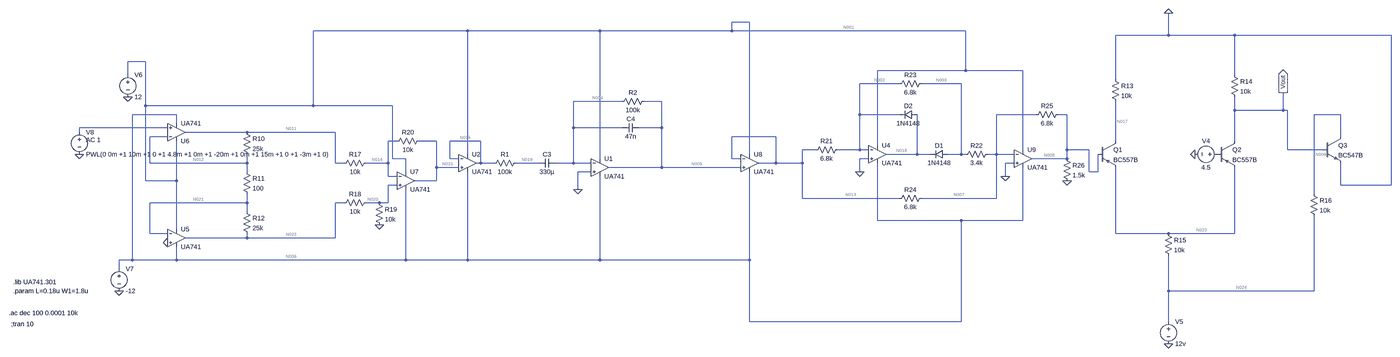
[diagram p0: schematic Project2final.asc, whole sheet]
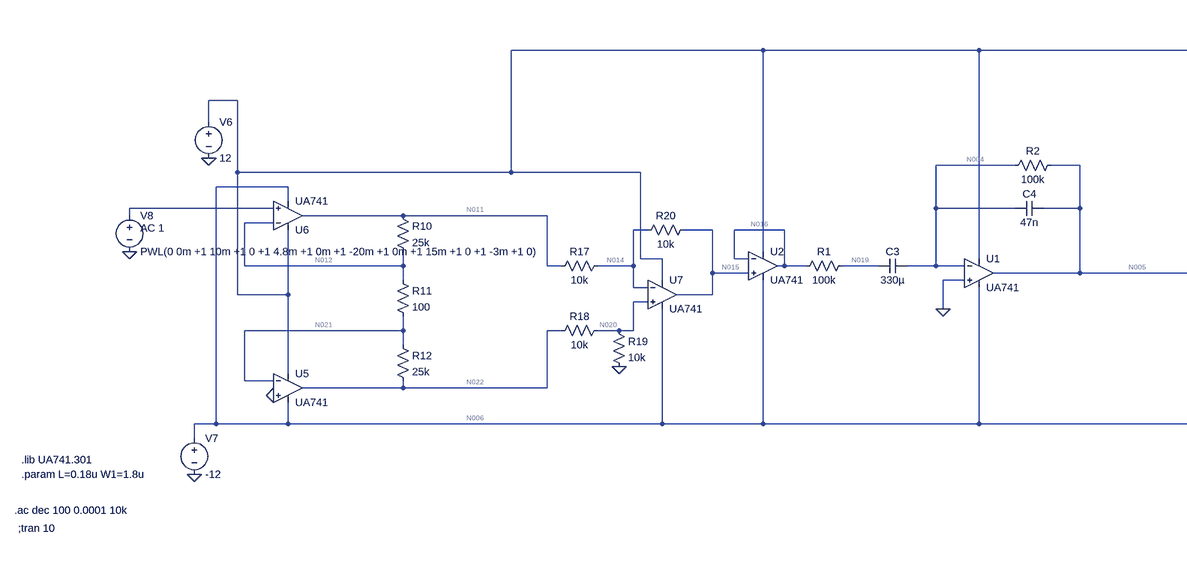
[diagram p1: schematic Project2final.asc, part, row 1 of 1, column 1 of 2]
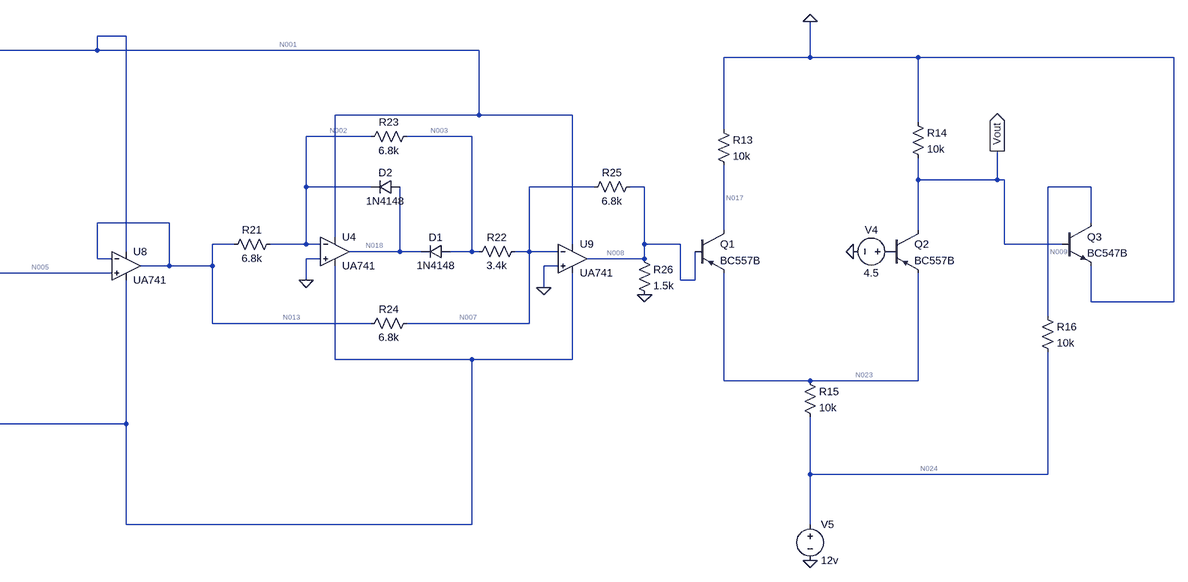
[diagram p2: schematic Project2final.asc, part, row 1 of 1, column 2 of 2]
Project2final.asc, the LTspice schematic file:
Version 4
SHEET 1 8356 2400
WIRE 2832 -224 2768 -224
WIRE 1776 -192 1216 -192
WIRE 2256 -192 1776 -192
WIRE 2768 -192 2768 -224
WIRE 2768 -192 2256 -192
WIRE 3616 -192 2768 -192
WIRE 4352 -176 4352 -256
WIRE 4352 -176 4160 -176
WIRE 4592 -176 4352 -176
WIRE 5200 -176 4592 -176
WIRE 608 -80 544 -80
WIRE 3616 -48 3616 -192
WIRE 3616 -48 3296 -48
WIRE 3824 -48 3616 -48
WIRE 544 -32 544 -80
WIRE 4592 -32 4592 -176
WIRE 4160 -16 4160 -176
WIRE 3376 0 3232 0
WIRE 3600 0 3456 0
WIRE 2336 64 2160 64
WIRE 2480 64 2416 64
WIRE 608 80 608 -80
WIRE 1216 80 1216 -192
WIRE 1216 80 608 80
WIRE 1504 80 1216 80
WIRE 4592 96 4592 48
WIRE 4768 96 4768 32
WIRE 4768 96 4592 96
WIRE 4784 96 4768 96
WIRE 720 112 560 112
WIRE 3232 112 3232 0
WIRE 3376 112 3232 112
WIRE 3872 112 3728 112
WIRE 3984 112 3952 112
WIRE 4976 112 4880 112
WIRE 720 144 720 112
WIRE 688 160 368 160
WIRE 2160 160 2160 64
WIRE 2336 160 2160 160
WIRE 2480 160 2480 64
WIRE 2480 160 2400 160
WIRE 368 176 368 160
WIRE 976 176 752 176
WIRE 1296 176 976 176
WIRE 688 192 624 192
WIRE 2928 192 2768 192
WIRE 4976 192 4976 112
WIRE 1520 208 1488 208
WIRE 1664 208 1600 208
WIRE 1824 208 1712 208
WIRE 4160 208 4160 64
WIRE 4592 208 4592 96
WIRE 3296 224 3296 -48
WIRE 3072 240 3024 240
WIRE 3232 240 3232 112
WIRE 3232 240 3152 240
WIRE 3264 240 3232 240
WIRE 3824 240 3824 -48
WIRE 3984 240 3984 112
WIRE 4064 240 3984 240
WIRE 4784 240 4784 96
WIRE 4912 240 4784 240
WIRE 1776 256 1776 -192
WIRE 2832 256 2832 -224
WIRE 3440 256 3440 112
WIRE 3440 256 3328 256
WIRE 3488 256 3440 256
WIRE 3600 256 3600 0
WIRE 3600 256 3552 256
WIRE 3616 256 3600 256
WIRE 3728 256 3728 112
WIRE 3728 256 3696 256
WIRE 3792 256 3728 256
WIRE 1504 272 1504 80
WIRE 1552 272 1504 272
WIRE 1712 272 1712 208
WIRE 1744 272 1712 272
WIRE 2256 272 2256 -192
WIRE 2768 272 2768 192
WIRE 2800 272 2768 272
WIRE 3264 272 3232 272
WIRE 3984 272 3984 240
WIRE 3984 272 3856 272
WIRE 624 288 624 192
WIRE 976 288 976 256
WIRE 976 288 624 288
WIRE 1296 288 1296 176
WIRE 1328 288 1296 288
WIRE 1488 288 1488 208
WIRE 1488 288 1408 288
WIRE 1824 288 1824 208
WIRE 1824 288 1808 288
WIRE 1872 288 1824 288
WIRE 2032 288 1952 288
WIRE 2160 288 2160 160
WIRE 2160 288 2096 288
WIRE 2224 288 2160 288
WIRE 2928 288 2928 192
WIRE 2928 288 2864 288
WIRE 3024 288 3024 240
WIRE 3024 288 2928 288
WIRE 3792 288 3760 288
WIRE 1664 304 1664 208
WIRE 1744 304 1664 304
WIRE 2480 304 2480 160
WIRE 2480 304 2288 304
WIRE 2800 304 2480 304
WIRE 976 320 976 288
WIRE 1552 320 1552 272
WIRE 2224 320 2176 320
WIRE 3232 320 3232 272
WIRE 4064 320 4064 240
WIRE 4096 320 4096 256
WIRE 4096 320 4064 320
WIRE 1488 336 1488 288
WIRE 1520 336 1488 336
WIRE 3760 336 3760 288
WIRE 608 352 608 80
WIRE 720 352 720 208
WIRE 720 352 608 352
WIRE 1664 352 1664 304
WIRE 1664 352 1584 352
WIRE 1520 368 1488 368
WIRE 4976 368 4976 288
WIRE 5200 368 5200 -176
WIRE 5200 368 4976 368
WIRE 2176 384 2176 320
WIRE 4880 400 4880 112
WIRE 3024 416 3024 288
WIRE 3376 416 3024 416
WIRE 3728 416 3728 256
WIRE 3728 416 3456 416
WIRE 976 432 976 400
WIRE 976 432 624 432
WIRE 1328 432 1296 432
WIRE 1456 432 1408 432
WIRE 1488 432 1488 368
WIRE 1488 432 1456 432
WIRE 976 464 976 432
WIRE 3296 496 3296 288
WIRE 3600 496 3296 496
WIRE 3824 496 3824 304
WIRE 3824 496 3600 496
WIRE 720 528 720 352
WIRE 624 544 624 432
WIRE 688 544 624 544
WIRE 4160 544 4160 304
WIRE 4352 544 4160 544
WIRE 4592 544 4592 304
WIRE 4592 544 4352 544
WIRE 976 560 976 544
WIRE 976 560 752 560
WIRE 1296 560 1296 432
WIRE 1296 560 976 560
WIRE 560 640 560 112
WIRE 560 640 512 640
WIRE 720 640 720 592
WIRE 720 640 560 640
WIRE 1552 640 1552 384
WIRE 1552 640 720 640
WIRE 1776 640 1776 320
WIRE 1776 640 1552 640
WIRE 2256 640 2256 336
WIRE 2256 640 1776 640
WIRE 2832 640 2832 320
WIRE 2832 640 2256 640
WIRE 512 672 512 640
WIRE 4352 752 4352 624
WIRE 4880 752 4880 480
WIRE 4880 752 4352 752
WIRE 2832 864 2832 640
WIRE 3600 864 3600 496
WIRE 3600 864 2832 864
WIRE 4352 864 4352 752
FLAG 4448 256 0
FLAG 4352 944 0
FLAG 4352 -256 0
FLAG 4768 32 Vout
IOPIN 4768 32 Out
FLAG 3984 352 0
FLAG 3760 336 0
FLAG 3232 320 0
FLAG 1456 512 0
FLAG 512 752 0
FLAG 544 48 0
FLAG 688 576 0
FLAG 368 256 0
FLAG 2176 384 0
SYMBOL pnp 4096 208 R0
SYMATTR InstName Q1
SYMATTR Value BC557B
SYMBOL res 4144 -32 R0
SYMATTR InstName R13
SYMATTR Value 10k
SYMBOL pnp 4528 208 R0
SYMATTR InstName Q2
SYMATTR Value BC557B
SYMBOL res 4336 528 R0
SYMATTR InstName R15
SYMATTR Value 10k
SYMBOL voltage 4544 256 R90
WINDOW 0 -32 56 VBottom 2
WINDOW 3 32 56 VTop 2
WINDOW 123 0 0 Left 0
WINDOW 39 0 0 Left 0
SYMATTR InstName V4
SYMATTR Value 4.5
SYMBOL voltage 4352 848 R0
WINDOW 123 0 0 Left 0
WINDOW 39 0 0 Left 0
SYMATTR InstName V5
SYMATTR Value 12v
SYMBOL res 4864 384 R0
SYMATTR InstName R16
SYMATTR Value 10k
SYMBOL npn 4912 192 R0
SYMATTR InstName Q3
SYMATTR Value BC547B
SYMBOL res 4576 -48 R0
SYMATTR InstName R14
SYMATTR Value 10k
SYMBOL OpAmps\\opamp2 3296 192 R0
SYMATTR InstName U4
SYMATTR Value UA741
SYMBOL diode 3440 96 R90
WINDOW 0 0 32 VBottom 2
WINDOW 3 32 32 VTop 2
SYMATTR InstName D2
SYMATTR Value 1N4148
SYMBOL res 3168 224 R90
WINDOW 0 0 56 VBottom 2
WINDOW 3 32 56 VTop 2
SYMATTR InstName R21
SYMATTR Value 6.8k
SYMBOL res 3712 240 R90
WINDOW 0 0 56 VBottom 2
WINDOW 3 32 56 VTop 2
SYMATTR InstName R22
SYMATTR Value 3.4k
SYMBOL res 3472 -16 R90
WINDOW 0 0 56 VBottom 2
WINDOW 3 32 56 VTop 2
SYMATTR InstName R23
SYMATTR Value 6.8k
SYMBOL res 3472 400 R90
WINDOW 0 0 56 VBottom 2
WINDOW 3 32 56 VTop 2
SYMATTR InstName R24
SYMATTR Value 6.8k
SYMBOL res 3968 96 R90
WINDOW 0 0 56 VBottom 2
WINDOW 3 32 56 VTop 2
SYMATTR InstName R25
SYMATTR Value 6.8k
SYMBOL OpAmps\\opamp2 3824 208 R0
SYMATTR InstName U9
SYMATTR Value UA741
SYMBOL res 3968 256 R0
SYMATTR InstName R26
SYMATTR Value 1.5k
SYMBOL OpAmps\\opamp2 2832 224 R0
SYMATTR InstName U8
SYMATTR Value UA741
SYMBOL res 960 160 R0
SYMATTR InstName R10
SYMATTR Value 25k
SYMBOL res 960 304 R0
SYMATTR InstName R11
SYMATTR Value 100
SYMBOL res 960 448 R0
SYMATTR InstName R12
SYMATTR Value 25k
SYMBOL OpAmps\\opamp2 720 496 R0
SYMATTR InstName U5
SYMATTR Value UA741
SYMBOL res 1424 272 R90
WINDOW 0 0 56 VBottom 2
WINDOW 3 32 56 VTop 2
SYMATTR InstName R17
SYMATTR Value 10k
SYMBOL res 1424 416 R90
WINDOW 0 0 56 VBottom 2
WINDOW 3 32 56 VTop 2
SYMATTR InstName R18
SYMATTR Value 10k
SYMBOL res 1440 416 R0
SYMATTR InstName R19
SYMATTR Value 10k
SYMBOL res 1616 192 R90
WINDOW 0 0 56 VBottom 2
WINDOW 3 32 56 VTop 2
SYMATTR InstName R20
SYMATTR Value 10k
SYMBOL OpAmps\\opamp2 720 240 M180
SYMATTR InstName U6
SYMATTR Value UA741
SYMBOL voltage 544 -48 R0
SYMATTR InstName V6
SYMATTR Value 12
SYMBOL voltage 512 656 R0
SYMATTR InstName V7
SYMATTR Value -12
SYMBOL OpAmps\\opamp2 1552 288 R0
SYMATTR InstName U7
SYMATTR Value UA741
SYMBOL voltage 368 160 R0
WINDOW 123 24 44 Left 2
WINDOW 39 0 0 Left 0
SYMATTR Value2 AC 1
SYMATTR InstName V8
SYMATTR Value PWL(0 0m +1 10m +1 0 +1 4.8m +1 0m +1 -20m +1 0m +1 15m +1 0 +1 -3m +1 0)
SYMBOL res 1968 272 R90
WINDOW 0 0 56 VBottom 2
WINDOW 3 32 56 VTop 2
SYMATTR InstName R1
SYMATTR Value 100k
SYMBOL cap 2096 272 R90
WINDOW 0 0 32 VBottom 2
WINDOW 3 32 32 VTop 2
SYMATTR InstName C3
SYMATTR Value 330µ
SYMBOL res 2432 48 R90
WINDOW 0 0 56 VBottom 2
WINDOW 3 32 56 VTop 2
SYMATTR InstName R2
SYMATTR Value 100k
SYMBOL cap 2400 144 R90
WINDOW 0 0 32 VBottom 2
WINDOW 3 32 32 VTop 2
SYMATTR InstName C4
SYMATTR Value 47n
SYMBOL OpAmps\\opamp2 2256 240 R0
SYMATTR InstName U1
SYMATTR Value UA741
SYMBOL OpAmps\\opamp2 1776 224 R0
SYMATTR InstName U2
SYMATTR Value UA741
SYMBOL diode 3552 240 R90
WINDOW 0 0 32 VBottom 2
WINDOW 3 32 32 VTop 2
SYMATTR InstName D1
SYMATTR Value 1N4148
TEXT 120 872 Left 2 !;tran 10
TEXT 128 720 Left 2 !.lib UA741.301
TEXT 128 752 Left 2 !.param L=0.18u W1=1.8u
TEXT 112 832 Left 2 !.ac dec 100 0.0001 10k

The netlist it stands for:
* Project2final.asc
Q1 N017 N008 N023 0 BC557B
R13 0 N017 10k
Q2 Vout P001 N023 0 BC557B
R15 N023 N024 10k
V4 P001 0 4.5
V5 N024 0 12v
R16 N009 N024 10k
Q3 N009 Vout 0 0 BC547B
R14 0 Vout 10k
XU4 0 N002 N001 N006 N018 UA741  ; pins In+ In- V+ V- OUT
D2 N018 N002 1N4148
R21 N002 N013 6.8k
R22 N007 N003 3.4k
R23 N003 N002 6.8k
R24 N007 N013 6.8k
R25 N008 N007 6.8k
XU9 0 N007 N001 N006 N008 UA741  ; pins In+ In- V+ V- OUT
R26 N008 0 1.5k
XU8 N005 N013 N001 N006 N013 UA741  ; pins In+ In- V+ V- OUT
R10 N011 N012 25k
R11 N012 N021 100
R12 N021 N022 25k
XU5 0 N021 N001 N006 N022 UA741  ; pins In+ In- V+ V- OUT
R17 N014 N011 10k
R18 N020 N022 10k
R19 N020 0 10k
R20 N015 N014 10k
XU6 N010 N012 N001 N006 N011 UA741  ; pins In+ In- V+ V- OUT
V6 N001 0 12
V7 N006 0 -12
XU7 N020 N014 N001 N006 N015 UA741  ; pins In+ In- V+ V- OUT
V8 N010 0 PWL(0 0m +1 10m +1 0 +1 4.8m +1 0m +1 -20m +1 0m +1 15m +1 0 +1 -3m +1 0) AC 1
R1 N019 N016 100k
C3 N004 N019 330µ
R2 N005 N004 100k
C4 N005 N004 47n
XU1 0 N004 N001 N006 N005 UA741  ; pins In+ In- V+ V- OUT
XU2 N015 N016 N001 N006 N016 UA741  ; pins In+ In- V+ V- OUT
D1 N003 N018 1N4148
.model D D
.lib standard.dio
.model NPN NPN
.model PNP PNP
.lib standard.bjt
;tran 10
.lib UA741.301
.param L=0.18u W1=1.8u
.ac dec 100 0.0001 10k
.backanno
.end

* Results of the author's LTspice run, read from the files saved beside the schematic
* Operating Point, zero values left out:
*   V(n017) = 694.3 mV
*   V(n008) = 7.421 mV
*   V(n023) = 700.4 mV
*   V(vout) = 168.5 nV
*   V(p001) = 4.5 V
*   V(n024) = 12 V
*   V(n009) = 12 V
*   V(n018) = -332.4 mV
*   V(n006) = -12 V
*   V(n001) = 12 V
*   V(n002) = 12.71 µV
*   V(n013) = 7.998 mV
*   V(n007) = 12.61 µV
*   V(n003) = -7.413 mV
*   V(n005) = 7.987 mV
*   V(n011) = 2.005 mV
*   V(n012) = 11.18 µV
*   V(n021) = 11.18 µV
*   V(n022) = 2.005 mV
*   V(n014) = 615.1 µV
*   V(n020) = 603.9 µV
*   V(n015) = 22.57 µV
*   V(n019) = 33.75 µV
*   V(n016) = 33.75 µV
*   V(n004) = 11.15 µV
*   Ic(Q1) = -69.43 µA
*   Ib(Q1) = -1.061 mA
*   Ie(Q1) = 1.13 mA
*   Ic(Q2) = -4.788 pA
*   Ib(Q2) = 8.6 pA
*   Ie(Q2) = -3.812 pA
*   Ic(Q3) = 12.09 pA
*   Ib(Q3) = -12.07 pA
*   I(D2) = -2.519 nA
*   I(D1) = 3.276 µA
*   I(R13) = -69.43 µA
*   I(R15) = -1.13 mA
*   I(R16) = -12.09 pA
*   I(R14) = -16.85 pA
*   I(R21) = -1.174 µA
*   I(R22) = 2.184 µA
*   I(R23) = -1.092 µA
*   I(R24) = -1.174 µA
*   I(R25) = 1.089 µA
*   I(R26) = 4.947 µA
*   I(R10) = 79.76 nA
*   I(R12) = -79.76 nA
*   I(R17) = -139 nA
*   I(R18) = -140.1 nA
*   I(R19) = 60.39 nA
*   I(R20) = -59.25 nA
*   I(R2) = 79.76 nA
*   I(V4) = -8.6 pA
*   I(V5) = -1.13 mA
*   I(V6) = -10.68 mA
*   I(V7) = 10.68 mA
*   I(V8) = -79.74 nA
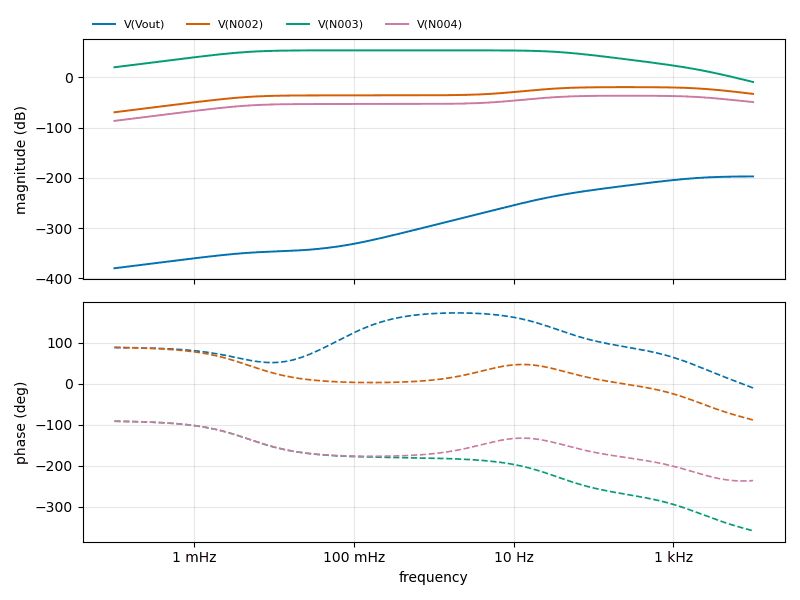
[diagram p3: AC Analysis of Project2final.asc, plotted from the saved traces]
* AC Analysis, 1 run:
*   V(Vout): -379.74 dB at 100 µHz, -196.89 dB at 10 kHz, peak -196.89 dB at 10 kHz, 3 dB below the peak at 2.08 kHz
*   V(N002): -69.28 dB at 100 µHz, -32.72 dB at 10 kHz, peak -19.24 dB at 269.2 Hz, 3 dB below the peak at 32.09 Hz and 2.21 kHz
*   V(N003): 20.31 dB at 100 µHz, -9.03 dB at 10 kHz, peak 53.97 dB at 407.4 mHz, 3 dB below the peak at 4.822 mHz and 33.86 Hz
*   V(N004): -86.44 dB at 100 µHz, -48.98 dB at 10 kHz, peak -36.33 dB at 269.2 Hz, 3 dB below the peak at 32.1 Hz and 2.231 kHz